# EAGLE design USB3A1P_0v0 (EAGLE 9.6.2)
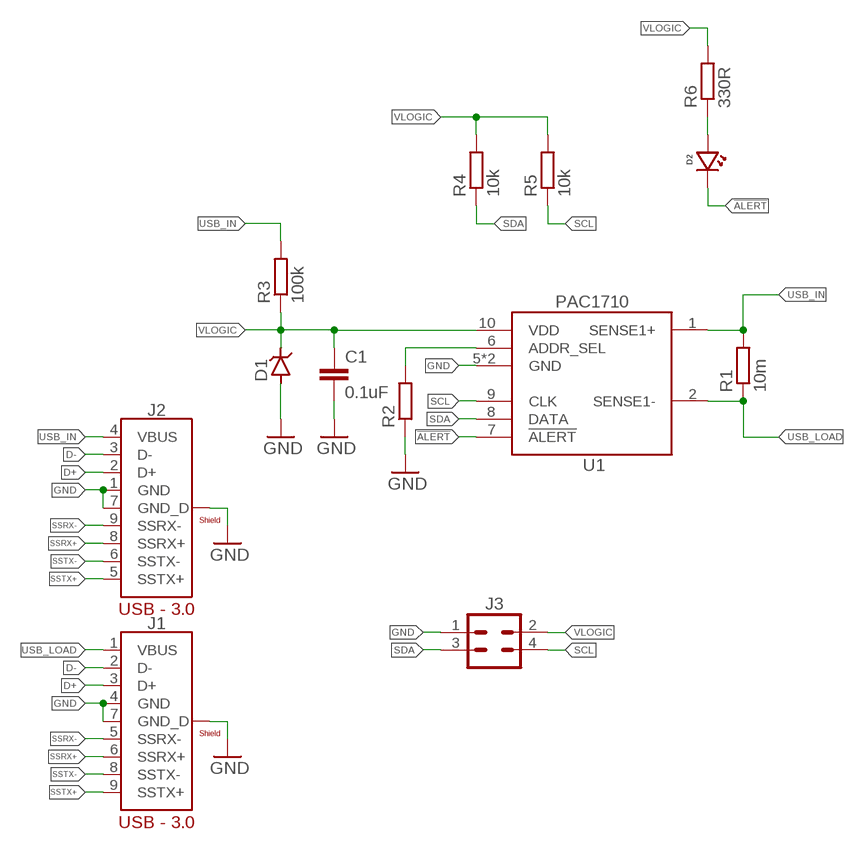
[diagram p0: schematic, sheet 1]

## Parts
C1  0.1uF  C-EU0.1UFC0603  [C0603]
D1  DIODE_ZENERSOD-123  [SOD-123]
D2  LED1206_BOTTOM  [LED_1206_BOTTOM]
J1  USB_3.0FEMALE_TENSILITY  [USB_A_3.0_FEMALE_TENSILITY]
J2  USB_3.0MALE_TENSILITY  [USB_A_3.0_MALE_TENSILITY]
J3  CONN_2X2MIRCOFIT_RT  [2X2_MICROFIT_RT]
R1  10m  R-EU_0.01R0805  [R0805]
R2  R-EU_R0603  [R0603]
R3  100k  R-EU_100KR0603  [R0603]
R4  10k  R-EU_10KR0603  [R0603]
R5  10k  R-EU_10KR0603  [R0603]
R6  330R  R-EU_330R0603  [R0603]
U1  PAC1710  [VDFN-10]

## Nets
!ALERT: D2.CATHODE U1.7(!ALERT)
D+: J1.3(D+) J2.2(D+)
D-: J1.2(D-) J2.3(D-)
GND: C1.2 D1.ANODE(A) J1.4(GND) J1.7(GND_D) J1.BODY@1(SHIELD) J1.BODY@2(SHIELD) J2.1(GND) J2.7(GND_D) J2.BODY@1(SHIELD) J2.BODY@2(SHIELD) J2.BODY@3(SHIELD) J2.BODY@4(SHIELD) J3.1 R2.1 U1.5(GND) U1.EP(GND)
N$1: R2.2 U1.6(ADDR_SEL)
N$2: D2.ANODE R6.1
SCL: J3.4 R5.1 U1.9(CLK)
SDA: J3.3 R4.1 U1.8(DATA)
SSRX+: J1.6(SSRX+) J2.8(SSRX+)
SSRX-: J1.5(SSRX-) J2.9(SSRX-)
SSTX+: J1.9(SSTX+) J2.5(SSTX+)
SSTX-: J1.8(SSTX-) J2.6(SSTX-)
USB_IN: J2.4(VBUS) R1.2 R3.2 U1.1(SENSE1+)
USB_LOAD: J1.1(VBUS) R1.1 U1.2(SENSE1-)
VLOGIC: C1.1 D1.CAT(C) J3.2 R3.1 R4.2 R5.2 R6.2 U1.10(VDD)

## Library data of the parts
C1 = bschulz_passives:C-EU: CAPACITOR, European symbol; DIGIKEY: 490-6051-1-ND; MF: Murata; MPN: GCM188R71E104KA57D
D1 = bschulz:DIODE_ZENER: Generic Zener Diode
D2 = bschulz:LED: Genaric LED
J1 = bschulz:USB_3.0: Generic USB 3.0 Connector; MF: Tensility; MPN: 54-00007
J2 = bschulz:USB_3.0: Generic USB 3.0 Connector; MF: Tensility; MPN: 50-00469
J3 = bschulz:CONN_2X2: Genaric 2x2 terminal header; DIGIKEY: WM1814-ND; MF: Molex; MPN: 0430450400
R1 = bschulz_passives:R-EU_: RESISTOR, European symbol Digikey Parts: Yageo, 0402 <https://www.digikey.com/products/en/resistors/chip-resistor-surface-mount/52?k=&pkeyword=&sv=0&s=4356&sf=1&FV=-1%7C13%2C7%7C2%2C1291%7C39157%2C1989%7C0%2C-8%7C52%2C3%7C1131%2C3%7C2503&quantity=&ColumnSort=0&page=1&stock=1&pageSize=25> Yageo, 0603 <https://www.digikey.com/products/en/resistors/chip-resistor-surface-mount/52?k=&pkeyword=&sv=0&pv1291=39245&sf=1&FV=-5%7C4356%2C-5%7C47360%2C-8%7C52%2C-1%7C13%2C7%7C2%2C1989%7C0&quantity=10&ColumnSort=1000011&page=1&stock=1&pageSize=25> Panasonic, 0603 <https://www.digikey.com/products/en/resistors/chip-resistor-surface-mount/52?k=&pkeyword=&pv252=68&sf=0&FV=ffec373d%2C1c0002%2C142c040c%2C1f140000%2Cffe00034%2C80002%2Cc0001&quantity=&ColumnSort=0&page=1&stock=1&pageSize=25> Panasonic, precision, 0603 <https://www.digikey.com/products/en/resistors/chip-resistor-surface-mount/52?FV=ffec4907%2Cfffc000a%2Cc0172%2C142c040c%2C1f140000%2Cffe00034%2C1c0002&quantity=100&ColumnSort=2085&page=1&stock=1&pageSize=25> Panasonic, 0805 <https://www.digikey.com/products/en/resistors/chip-resistor-surface-mount/52?k=&pkeyword=&pv3=1&sf=0&FV=ffec373d%2C1c0002%2C1f140000%2Cffe00034%2C142c040d&quantity=&ColumnSort=0&page=1&stock=1&pageSize=25> Rohm, current sense <https://www.digikey.com/products/en/resistors/chip-resistor-surface-mount/52?k=&pkeyword=&pv3=1&sf=0&FV=ffecb688%2C1f140000%2Cffe00034%2C1c0002&quantity=&ColumnSort=0&page=1&stock=1&pageSize=25> Vishay, pulse proof automotive <https://www.digikey.com/products/en/resistors/chip-resistor-surface-mount/52?k=&pkeyword=&pv7=2&sf=0&FV=ffec5d6b%2Cffe00034%2C1f140000&quantity=&ColumnSort=0&page=1&stock=1&pageSize=25>; DIGIKEY: CRF0805-FZ-R010ELFCT-ND; MF: Bourns; MPN: CRF0805-FZ-R010ELF
R2 = bschulz_passives:R-EU_: RESISTOR, European symbol Digikey Parts: Yageo, 0402 <https://www.digikey.com/products/en/resistors/chip-resistor-surface-mount/52?k=&pkeyword=&sv=0&s=4356&sf=1&FV=-1%7C13%2C7%7C2%2C1291%7C39157%2C1989%7C0%2C-8%7C52%2C3%7C1131%2C3%7C2503&quantity=&ColumnSort=0&page=1&stock=1&pageSize=25> Yageo, 0603 <https://www.digikey.com/products/en/resistors/chip-resistor-surface-mount/52?k=&pkeyword=&sv=0&pv1291=39245&sf=1&FV=-5%7C4356%2C-5%7C47360%2C-8%7C52%2C-1%7C13%2C7%7C2%2C1989%7C0&quantity=10&ColumnSort=1000011&page=1&stock=1&pageSize=25> Panasonic, 0603 <https://www.digikey.com/products/en/resistors/chip-resistor-surface-mount/52?k=&pkeyword=&pv252=68&sf=0&FV=ffec373d%2C1c0002%2C142c040c%2C1f140000%2Cffe00034%2C80002%2Cc0001&quantity=&ColumnSort=0&page=1&stock=1&pageSize=25> Panasonic, precision, 0603 <https://www.digikey.com/products/en/resistors/chip-resistor-surface-mount/52?FV=ffec4907%2Cfffc000a%2Cc0172%2C142c040c%2C1f140000%2Cffe00034%2C1c0002&quantity=100&ColumnSort=2085&page=1&stock=1&pageSize=25> Panasonic, 0805 <https://www.digikey.com/products/en/resistors/chip-resistor-surface-mount/52?k=&pkeyword=&pv3=1&sf=0&FV=ffec373d%2C1c0002%2C1f140000%2Cffe00034%2C142c040d&quantity=&ColumnSort=0&page=1&stock=1&pageSize=25> Rohm, current sense <https://www.digikey.com/products/en/resistors/chip-resistor-surface-mount/52?k=&pkeyword=&pv3=1&sf=0&FV=ffecb688%2C1f140000%2Cffe00034%2C1c0002&quantity=&ColumnSort=0&page=1&stock=1&pageSize=25> Vishay, pulse proof automotive <https://www.digikey.com/products/en/resistors/chip-resistor-surface-mount/52?k=&pkeyword=&pv7=2&sf=0&FV=ffec5d6b%2Cffe00034%2C1f140000&quantity=&ColumnSort=0&page=1&stock=1&pageSize=25>; MF: Yageo
R3 = bschulz_passives:R-EU_: RESISTOR, European symbol Digikey Parts: Yageo, 0402 <https://www.digikey.com/products/en/resistors/chip-resistor-surface-mount/52?k=&pkeyword=&sv=0&s=4356&sf=1&FV=-1%7C13%2C7%7C2%2C1291%7C39157%2C1989%7C0%2C-8%7C52%2C3%7C1131%2C3%7C2503&quantity=&ColumnSort=0&page=1&stock=1&pageSize=25> Yageo, 0603 <https://www.digikey.com/products/en/resistors/chip-resistor-surface-mount/52?k=&pkeyword=&sv=0&pv1291=39245&sf=1&FV=-5%7C4356%2C-5%7C47360%2C-8%7C52%2C-1%7C13%2C7%7C2%2C1989%7C0&quantity=10&ColumnSort=1000011&page=1&stock=1&pageSize=25> Panasonic, 0603 <https://www.digikey.com/products/en/resistors/chip-resistor-surface-mount/52?k=&pkeyword=&pv252=68&sf=0&FV=ffec373d%2C1c0002%2C142c040c%2C1f140000%2Cffe00034%2C80002%2Cc0001&quantity=&ColumnSort=0&page=1&stock=1&pageSize=25> Panasonic, precision, 0603 <https://www.digikey.com/products/en/resistors/chip-resistor-surface-mount/52?FV=ffec4907%2Cfffc000a%2Cc0172%2C142c040c%2C1f140000%2Cffe00034%2C1c0002&quantity=100&ColumnSort=2085&page=1&stock=1&pageSize=25> Panasonic, 0805 <https://www.digikey.com/products/en/resistors/chip-resistor-surface-mount/52?k=&pkeyword=&pv3=1&sf=0&FV=ffec373d%2C1c0002%2C1f140000%2Cffe00034%2C142c040d&quantity=&ColumnSort=0&page=1&stock=1&pageSize=25> Rohm, current sense <https://www.digikey.com/products/en/resistors/chip-resistor-surface-mount/52?k=&pkeyword=&pv3=1&sf=0&FV=ffecb688%2C1f140000%2Cffe00034%2C1c0002&quantity=&ColumnSort=0&page=1&stock=1&pageSize=25> Vishay, pulse proof automotive <https://www.digikey.com/products/en/resistors/chip-resistor-surface-mount/52?k=&pkeyword=&pv7=2&sf=0&FV=ffec5d6b%2Cffe00034%2C1f140000&quantity=&ColumnSort=0&page=1&stock=1&pageSize=25>; DIGIKEY: 311-100KHRCT-ND; MF: Yageo; MPN: RC0603FR-07100KL; VALUE_PART: 100k
R4 R5 = bschulz_passives:R-EU_: RESISTOR, European symbol Digikey Parts: Yageo, 0402 <https://www.digikey.com/products/en/resistors/chip-resistor-surface-mount/52?k=&pkeyword=&sv=0&s=4356&sf=1&FV=-1%7C13%2C7%7C2%2C1291%7C39157%2C1989%7C0%2C-8%7C52%2C3%7C1131%2C3%7C2503&quantity=&ColumnSort=0&page=1&stock=1&pageSize=25> Yageo, 0603 <https://www.digikey.com/products/en/resistors/chip-resistor-surface-mount/52?k=&pkeyword=&sv=0&pv1291=39245&sf=1&FV=-5%7C4356%2C-5%7C47360%2C-8%7C52%2C-1%7C13%2C7%7C2%2C1989%7C0&quantity=10&ColumnSort=1000011&page=1&stock=1&pageSize=25> Panasonic, 0603 <https://www.digikey.com/products/en/resistors/chip-resistor-surface-mount/52?k=&pkeyword=&pv252=68&sf=0&FV=ffec373d%2C1c0002%2C142c040c%2C1f140000%2Cffe00034%2C80002%2Cc0001&quantity=&ColumnSort=0&page=1&stock=1&pageSize=25> Panasonic, precision, 0603 <https://www.digikey.com/products/en/resistors/chip-resistor-surface-mount/52?FV=ffec4907%2Cfffc000a%2Cc0172%2C142c040c%2C1f140000%2Cffe00034%2C1c0002&quantity=100&ColumnSort=2085&page=1&stock=1&pageSize=25> Panasonic, 0805 <https://www.digikey.com/products/en/resistors/chip-resistor-surface-mount/52?k=&pkeyword=&pv3=1&sf=0&FV=ffec373d%2C1c0002%2C1f140000%2Cffe00034%2C142c040d&quantity=&ColumnSort=0&page=1&stock=1&pageSize=25> Rohm, current sense <https://www.digikey.com/products/en/resistors/chip-resistor-surface-mount/52?k=&pkeyword=&pv3=1&sf=0&FV=ffecb688%2C1f140000%2Cffe00034%2C1c0002&quantity=&ColumnSort=0&page=1&stock=1&pageSize=25> Vishay, pulse proof automotive <https://www.digikey.com/products/en/resistors/chip-resistor-surface-mount/52?k=&pkeyword=&pv7=2&sf=0&FV=ffec5d6b%2Cffe00034%2C1f140000&quantity=&ColumnSort=0&page=1&stock=1&pageSize=25>; DIGIKEY: 311-10.0KHRCT-ND; MF: Yageo; MPN: RC0603FR-0710KL; VALUE_PART: 10k
R6 = bschulz_passives:R-EU_: RESISTOR, European symbol Digikey Parts: Yageo, 0402 <https://www.digikey.com/products/en/resistors/chip-resistor-surface-mount/52?k=&pkeyword=&sv=0&s=4356&sf=1&FV=-1%7C13%2C7%7C2%2C1291%7C39157%2C1989%7C0%2C-8%7C52%2C3%7C1131%2C3%7C2503&quantity=&ColumnSort=0&page=1&stock=1&pageSize=25> Yageo, 0603 <https://www.digikey.com/products/en/resistors/chip-resistor-surface-mount/52?k=&pkeyword=&sv=0&pv1291=39245&sf=1&FV=-5%7C4356%2C-5%7C47360%2C-8%7C52%2C-1%7C13%2C7%7C2%2C1989%7C0&quantity=10&ColumnSort=1000011&page=1&stock=1&pageSize=25> Panasonic, 0603 <https://www.digikey.com/products/en/resistors/chip-resistor-surface-mount/52?k=&pkeyword=&pv252=68&sf=0&FV=ffec373d%2C1c0002%2C142c040c%2C1f140000%2Cffe00034%2C80002%2Cc0001&quantity=&ColumnSort=0&page=1&stock=1&pageSize=25> Panasonic, precision, 0603 <https://www.digikey.com/products/en/resistors/chip-resistor-surface-mount/52?FV=ffec4907%2Cfffc000a%2Cc0172%2C142c040c%2C1f140000%2Cffe00034%2C1c0002&quantity=100&ColumnSort=2085&page=1&stock=1&pageSize=25> Panasonic, 0805 <https://www.digikey.com/products/en/resistors/chip-resistor-surface-mount/52?k=&pkeyword=&pv3=1&sf=0&FV=ffec373d%2C1c0002%2C1f140000%2Cffe00034%2C142c040d&quantity=&ColumnSort=0&page=1&stock=1&pageSize=25> Rohm, current sense <https://www.digikey.com/products/en/resistors/chip-resistor-surface-mount/52?k=&pkeyword=&pv3=1&sf=0&FV=ffecb688%2C1f140000%2Cffe00034%2C1c0002&quantity=&ColumnSort=0&page=1&stock=1&pageSize=25> Vishay, pulse proof automotive <https://www.digikey.com/products/en/resistors/chip-resistor-surface-mount/52?k=&pkeyword=&pv7=2&sf=0&FV=ffec5d6b%2Cffe00034%2C1f140000&quantity=&ColumnSort=0&page=1&stock=1&pageSize=25>; DIGIKEY: 311-330HRCT-ND; MF: Yageo; MPN: RC0603FR-07330RL; VALUE_PART: 330
U1 = bschulz:PAC1710: PAC1710 - High Side Current/Power Monitor with I2C Interface Characteristics: Vcc: 3V ~ 5.5V Iq: 5uA Common Mode Range: 0V ~ 40V Operating Temperature: -40°C to 85°C Digikey: PAC1720-1-AIA-CT-ND <https://www.digikey.com/product-detail/en/microchip-technology/PAC1710-1-AIA-TR/PAC1710-1-AIA-CT-ND/4490171>; DIGIKEY: PAC1710-1-AIA-CT-ND; MF: Microchip; MPN: PAC1710-1-AIA-TR

## Board
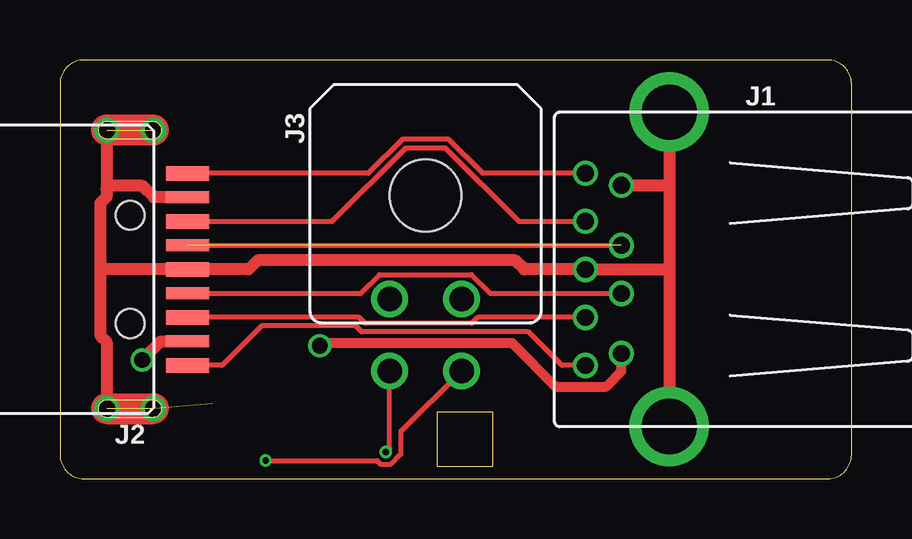
[diagram p1: board, top side]
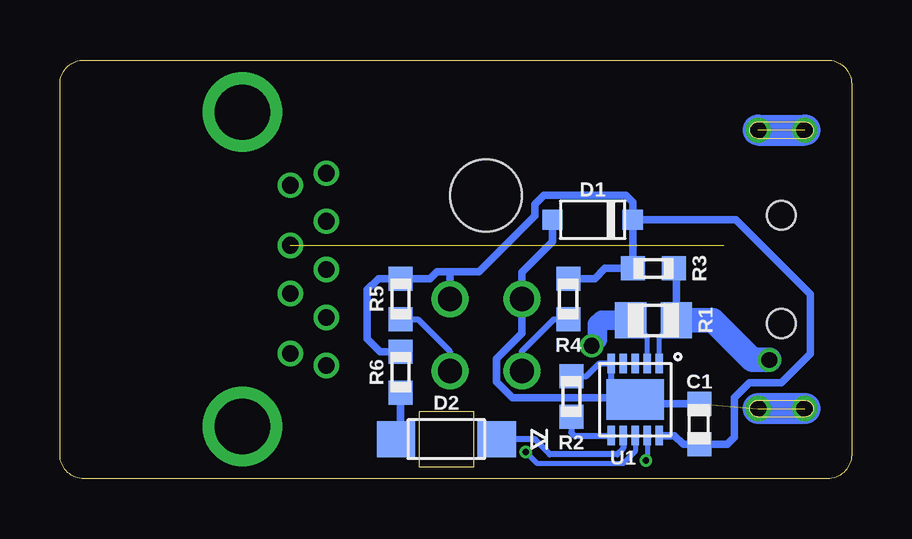
[diagram p2: board, bottom side, seen from below]

Size 33 x 17.45 mm. Coordinates in mm from the lower left corner, seen from the top.
Outline: 32,17.45 1,17.45 arc90 0,16.45 0,1 arc90 1,0 32,0 arc90 33,1 33,16.45 arc90 32,17.45
Copper layers (1*16): Top 0.035559375mm / dielectric 1.6mm / Bottom 0.035559375mm
Design rules "oshpark-2layer": minimum track width 6mil, minimum drill 10mil, track to track 6mil, track to pad 6mil, pad to pad 6mil, via to via 6mil, smd to smd 6mil, copper to edge 15mil, drill to drill 6mil, minimum pad ring 5mil, minimum via ring 5mil, stop-mask expansion 2.5mil, vias tented up to drill 0mil, thermal gap 10mil

### Footprints (pad centres in the part's own frame; a part is rotated, then mirrored left to right if it is on the bottom)
C0603 = smd 1 x 1: 1 -0.85,0; 2 0.85,0
SOD-123 = smd 0.85 x 0.85: ANODE 1.675,0; CAT -1.675,0
LED_1206_BOTTOM = smd 1.6 x 1.5: ANODE 2.1,0; CATHODE -2.1,0
USB_A_3.0_FEMALE_TENSILITY = drill 0.7: 1 3.5,-2; 2 1,-2; 3 -1,-2; 4 -3.5,-2; 5 -4,-3.5; 6 -2,-3.5; 7 0,-3.5; 8 2,-3.5; 9 4,-3.5 | drill 2.3: BODY@1 -6.55,0; BODY@2 6.55,0
USB_A_3.0_MALE_TENSILITY = smd 0.5 x 1.8: 1 -3,2.4; 2 -1,2.4; 3 1,2.4; 4 3,2.4 | smd 0.6 x 1.8: 5 4,2.4; 6 2,2.4; 7 0,2.4; 8 -2,2.4; 9 -4,2.4 | drill 0.7: BODY@1 -5.8,0.975; BODY@2 -5.8,-0.975; BODY@3 5.8,-0.975; BODY@4 5.8,0.975 | hole 1.2: -2.25,0; 2.25,0
2X2_MICROFIT_RT = drill 1.02: 1 1.5,4.32; 2 -1.5,4.32; 3 1.5,7.32; 4 -1.5,7.32 | hole 3: 0,0
R0805 = smd 1.3 x 1.5: 1 -0.95,0; 2 0.95,0
R0603 = smd 1 x 1: 1 -0.85,0; 2 0.85,0
VDFN-10 = smd 0.8 x 0.3: 1 -1.5,1; 2 -1.5,0.5; 3 -1.5,0; 4 -1.5,-0.5; 5 -1.5,-1; 6 1.5,-1; 7 1.5,-0.5; 8 1.5,0; 9 1.5,0.5; 10 1.5,1 | smd 1.7 x 2.4: EP 0,0

### Placement (x,y rotation side)
C1  6.35,2.29 90 bottom
D1  10.79,10.79 180 bottom
D2  16.89,1.65 180 bottom
J1  25.4,8.72 270 top
J2  2.92,8.72 270 top
J3  15.24,11.81 180 top
R1  8.26,6.6 0 bottom
R2  11.68,3.43 270 bottom
R3  8.26,8.76 0 bottom
R4  11.81,7.49 90 bottom
R5  18.8,7.49 90 bottom
R6  18.8,4.45 90 bottom
U1  9.02,3.3 270 bottom

### Tracks (layer width: path | path; a pad name or v marks a point on that pad's centre or on a via)
!ALERT
  Bottom 0.254: U1.7 9.52,1.28 9.78,1.02 12.57,1.02 13.21,1.65 D2.CATHODE
D+  (1 unrouted)
  Top 0.2: J2.2 J1.3
D-
  Top 0.2: J2.3 12.54,7.72 13.32,8.51 17.16,8.51 17.95,7.72 J1.2
GND  (3 unrouted)
  Top 0.508: J2.BODY@2 1.95,12.06 | 1.95,12.06 1.95,11.75 1.69,11.49 1.69,8.64 | J2.BODY@3 1.95,5.7 1.69,5.96 1.69,8.64 | 1.69,8.64 1.77,8.72 J2.7 7.86,8.72 8.24,9.11 18.98,9.11 19.36,8.72 J1.7 25.31,8.72 25.4,8.64 | J2.1 3.92,11.72 3.43,12.21 2.09,12.21 1.95,12.06 | J1.BODY@1 25.4,12.19 | 25.4,12.19 25.4,8.64 | 25.4,8.64 J1.BODY@2 | J1.4 25.37,12.22 25.4,12.19
  Bottom 0.254: 9.91,3.3 10.02,3.41 U1.5 10.53,4.8 11.05,4.28 R2.1 | 9.91,3.3 9.53,2.92 | U1.EP 9.91,3.3
  Bottom 0.305: C1.2 8.85,3.14 U1.EP 9.1,3.38 14.15,3.38 14.81,4.05 14.81,5 13.74,6.07 J3.1 13.74,8.61 12.47,9.88 D1.ANODE
N$1
  Bottom 0.254: R2.2 11.68,1.93 11.56,1.8 U1.6
N$2
  Bottom 0.305: D2.ANODE 18.8,1.85 R6.1
SCL  (via drill 0.25)
  Top 0.2: v8.57,0.76 13.22,0.76 13.38,0.61 13.79,0.61 14.2,1.02 14.2,1.95 J3.4
  Bottom 0.2: U1.9 8.52,0.81 v8.57,0.76
  Bottom 0.254: R5.1 18.07,6.64 16.74,5.31 J3.4
SDA  (via drill 0.25)
  Top 0.2: v13.59,1.12 13.74,1.27 J3.3
  Bottom 0.2: U1.8 9.02,1.14 9.52,0.64 13.1,0.64 v13.59,1.12
  Bottom 0.254: J3.3 13.74,5.31 12.41,6.64 R4.1
SSRX+
  Top 0.2: J2.8 11.35,10.72 14.42,13.79 16.06,13.79 19.13,10.72 J1.6
SSRX-
  Top 0.2: J1.5 17.63,12.72 16.21,14.14 14.27,14.14 12.85,12.72 J2.9
SSTX+
  Top 0.2: J2.5 6.76,4.72 8.41,6.37 12.33,6.37 12.58,6.12 19.53,6.12 20.93,4.72 J1.9
SSTX-
  Top 0.2: J2.6 12.47,6.72 12.72,6.47 17.16,6.47 17.41,6.72 J1.8
USB_IN  (via drill 0.65)
  Top 0.508: v3.43,4.95 4.2,5.72 J2.4
  Bottom 0.2: U1.1 8.02,5.89 R1.2
  Bottom 0.305: R1.2 7.3,8.66 R3.2
  Bottom 1.016: R1.2 5.78,6.6 4.13,4.95 v3.43,4.95
USB_LOAD  (via drill 0.65)
  Top 0.406: v10.84,5.54 10.96,5.67 18.84,5.67 20.67,3.84 22.77,3.84 23.4,4.47 J1.1
  Bottom 0.2: U1.2 8.52,5.92 R1.1
  Bottom 0.813: R1.1 10.41,6.6 10.59,6.43 10.59,5.8 v10.84,5.54
VLOGIC
  Bottom 0.305: R6.2 19.65,5.29 20.19,5.84 20.19,7.87 19.72,8.34 R5.2 17.57,8.34 17.27,8.64 16.76,8.64 | U1.10 7.38,1.8 7.02,1.44 C1.1 5.17,1.44 4.88,1.73 4.88,3.39 4.27,4 2.92,4 1.71,5.21 1.71,7.68 4.83,10.79 D1.CAT | D1.CAT 9.12,8.78 R3.1 10.29,8.76 10.71,8.34 R4.2 | D1.CAT 9.12,11.53 9.4,11.81 12.83,11.81 13.21,11.43 13.21,10.97 15.54,8.64 16.76,8.64 | J3.2 16.74,8.61 16.76,8.64

### Text on the board
tDocu: CSR: 10mΩ | ALERT | Project-Corvus / USB3A1P - v0.0 / Bobby Schulz